# EAGLE design AY Soundcard (EAGLE 6.5.0)
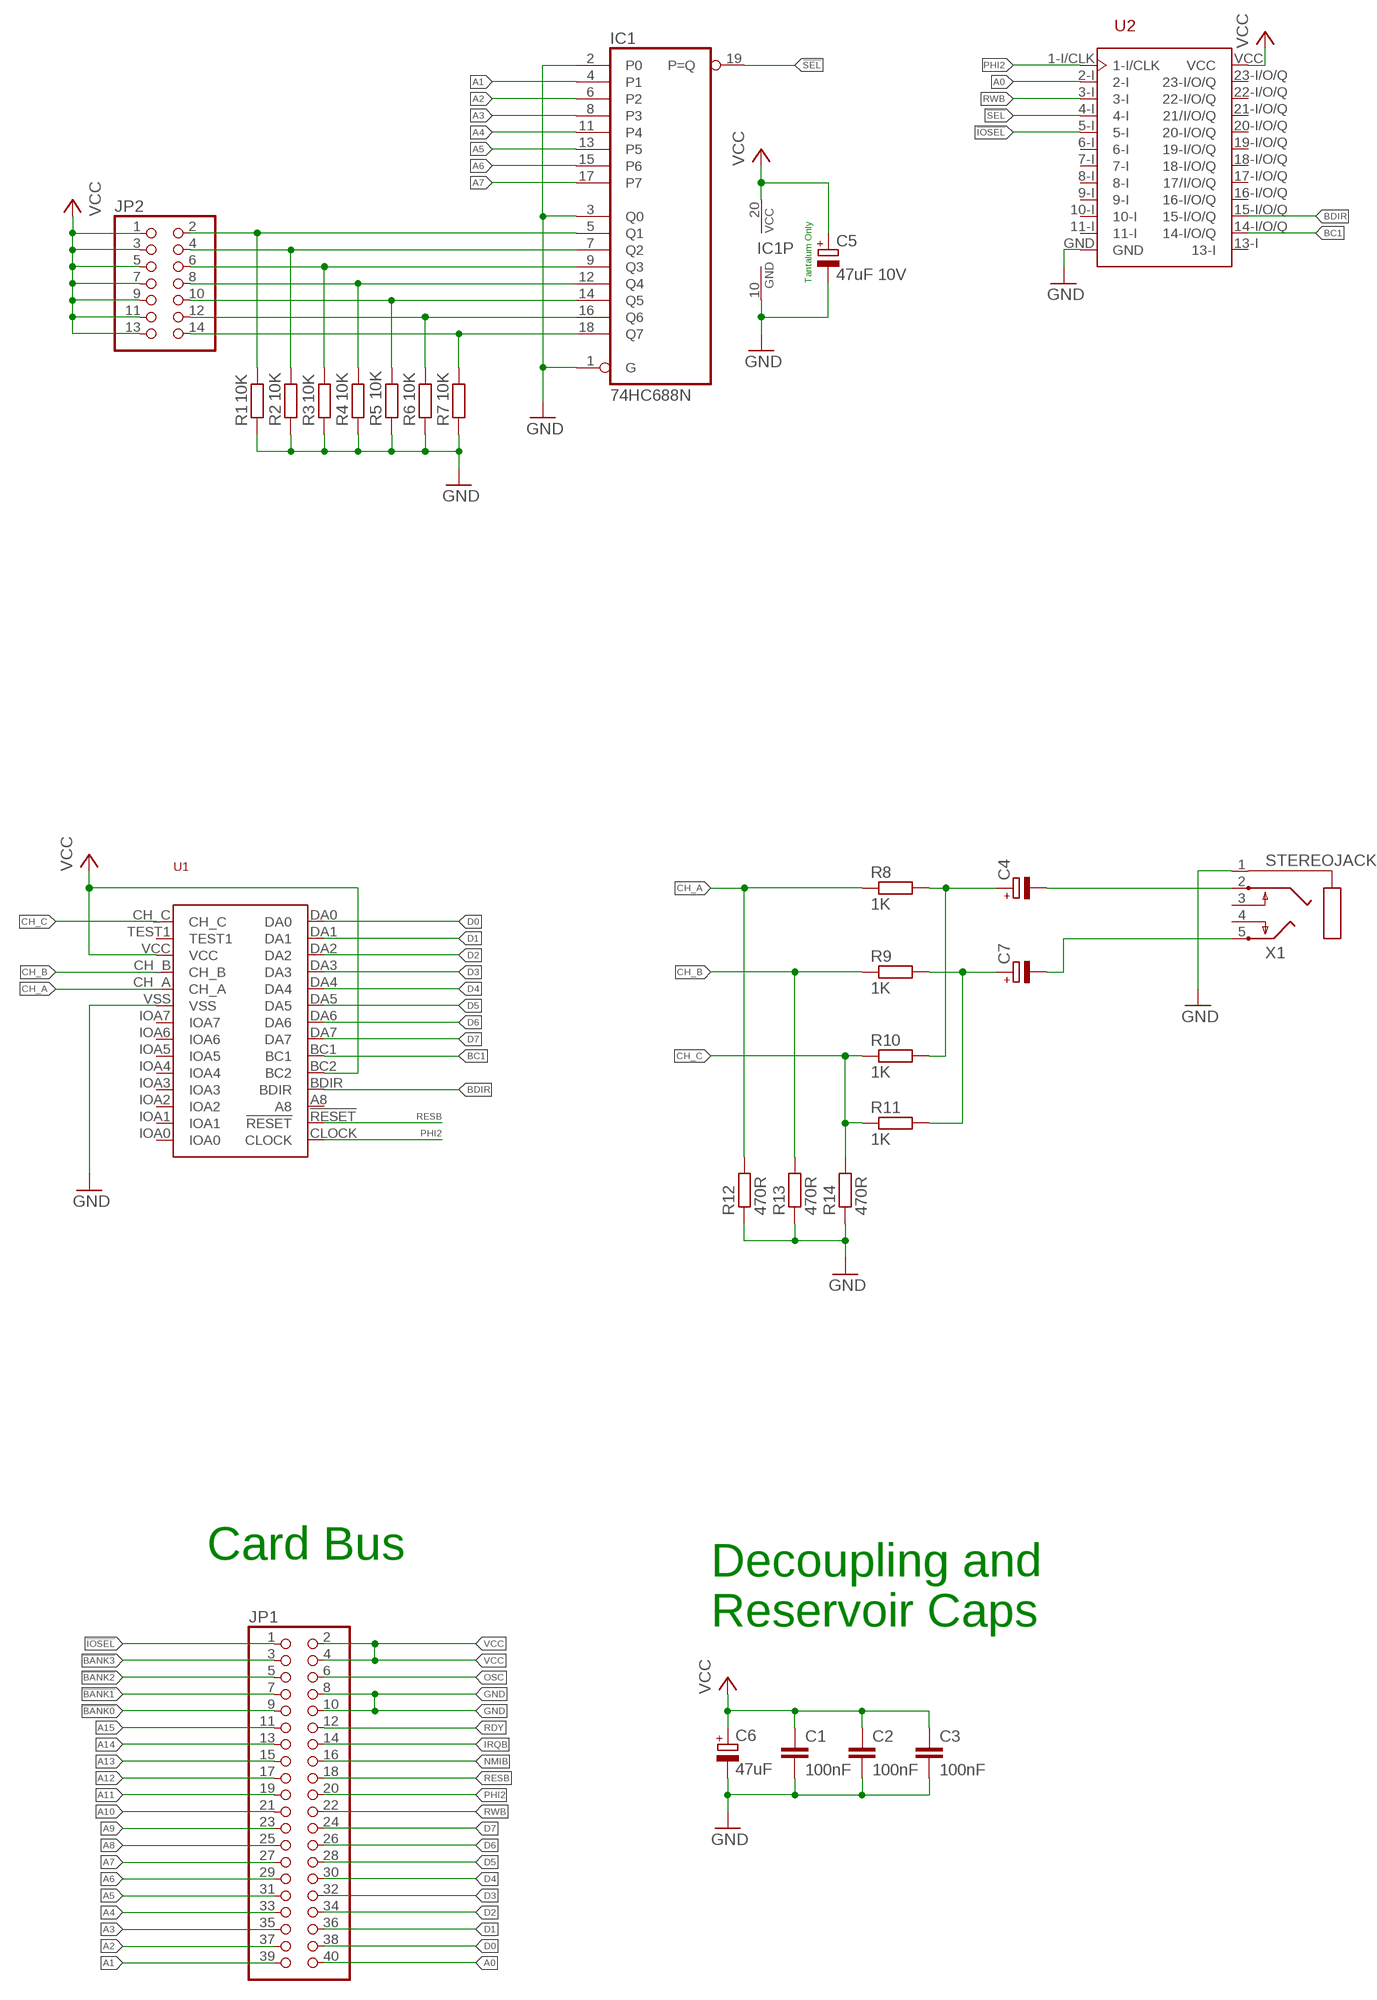
[diagram p0: schematic, sheet 1]

## Parts
C1  100nF  C-EU050-025X075  [C050-025X075]
C2  100nF  C-EU050-025X075  [C050-025X075]
C3  100nF  C-EU050-025X075  [C050-025X075]
C4  CPOL-EUE2-5  [E2-5]
C5  47uF 10V  CPOL-EUE5-6  [E5-6]
C6  47uF  CPOL-EUE2.5-7  [E2,5-7]
C7  CPOL-EUE2-5  [E2-5]
IC1  74HC688N  [DIL20]
JP1  PINHD-2X20/90  [2X20/90]
JP2  PINHD-2X7  [2X07]
R1  10K  R-EU_0207/2V  [0207/2V]
R2  10K  R-EU_0207/2V  [0207/2V]
R3  10K  R-EU_0207/2V  [0207/2V]
R4  10K  R-EU_0207/2V  [0207/2V]
R5  10K  R-EU_0207/2V  [0207/2V]
R6  10K  R-EU_0207/2V  [0207/2V]
R7  10K  R-EU_0207/2V  [0207/2V]
R8  1K  R-EU_0207/2V  [0207/2V]
R9  1K  R-EU_0207/2V  [0207/2V]
R10  1K  R-EU_0207/2V  [0207/2V]
R11  1K  R-EU_0207/2V  [0207/2V]
R12  470R  R-EU_0207/2V  [0207/2V]
R13  470R  R-EU_0207/10  [0207/10]
R14  470R  R-EU_0207/10  [0207/10]
U1  AY-3-8912-DIP  [DIP]
U2  GAL22V10D-DIP  [DIP24]
X1  STEREOJACK  [STX3100]

## Nets
!BANK0: JP1.9
!BANK1: JP1.7
!BANK2: JP1.5
!BANK3: JP1.3
!IOSEL: JP1.1 U2.5-I
!SEL: IC1.19(P=Q) U2.4-I
A0: JP1.40 U2.2-I
A1: IC1.4(P1) JP1.39
A2: IC1.6(P2) JP1.37
A3: IC1.8(P3) JP1.35
A4: IC1.11(P4) JP1.33
A5: IC1.13(P5) JP1.31
A6: IC1.15(P6) JP1.29
A7: IC1.17(P7) JP1.27
A8: JP1.25
A9: JP1.23
A10: JP1.21
A11: JP1.19
A12: JP1.17
A13: JP1.15
A14: JP1.13
A15: JP1.11
BC1: U1.BC1 U2.14-I/O/Q
BDIR: U1.BDIR U2.15-I/O/Q
CH_A: R8.1 R12.2 U1.CH_A
CH_B: R9.1 R13.2 U1.CH_B
CH_C: R10.1 R11.1 R14.2 U1.CH_C
D0: JP1.38 U1.DA0
D1: JP1.36 U1.DA1
D2: JP1.34 U1.DA2
D3: JP1.32 U1.DA3
D4: JP1.30 U1.DA4
D5: JP1.28 U1.DA5
D6: JP1.26 U1.DA6
D7: JP1.24 U1.DA7
GND: C1.2 C2.2 C3.2 C5.- C6.- IC1.1(G) IC1.2(P0) IC1.3(Q0) IC1.10(GND) JP1.8 JP1.10 R1.1 R2.1 R3.1 R4.1 R5.1 R6.1 R7.1 R12.1 R13.1 R14.1 U1.VSS U2.GND X1.1
IRQB: JP1.14
N$1: C4.+ R8.2 R10.2
N$2: C7.+ R9.2 R11.2
N$3: C4.- X1.2
N$4: C7.- X1.5
N$8: IC1.5(Q1) JP2.2 R1.2
N$9: IC1.7(Q2) JP2.4 R2.2
N$10: IC1.9(Q3) JP2.6 R3.2
N$11: IC1.12(Q4) JP2.8 R4.2
N$12: IC1.14(Q5) JP2.10 R5.2
N$13: IC1.16(Q6) JP2.12 R6.2
N$14: IC1.18(Q7) JP2.14 R7.2
NMIB: JP1.16
OSC: JP1.6
PHI2: JP1.20 U1.CLOCK U2.1-I/CLK
RDY: JP1.12
RESB: JP1.18 U1.!RESET
RWB: JP1.22 U2.3-I
VCC: C1.1 C2.1 C3.1 C5.+ C6.+ IC1.20(VCC) JP1.2 JP1.4 JP2.1 JP2.3 JP2.5 JP2.7 JP2.9 JP2.11 JP2.13 U1.BC2 U1.VCC U2.VCC
Unconnected: U1.A8 U1.IOA0 U1.IOA1 U1.IOA2 U1.IOA3 U1.IOA4 U1.IOA5 U1.IOA6 U1.IOA7 U1.TEST1 U2.6-I U2.7-I U2.8-I U2.9-I U2.10-I U2.11-I U2.13-I U2.16-I/O/Q U2.17-I/O/Q(17/I/O/Q) U2.18-I/O/Q U2.19-I/O/Q U2.20-I/O/Q U2.21-I/O/Q(21/I/O/Q) U2.22-I/O/Q U2.23-I/O/Q X1.3 X1.4

## Notes on the sheet
- Tantalum Only
- Card Bus
- Decoupling and
  Reservoir Caps

## Library data of the parts
C1-C3 = rcl:C-EU: CAPACITOR, European symbol
C4-C7 = rcl:CPOL-EU: POLARIZED CAPACITOR, European symbol
IC1 = 74xx-eu:74*688: 8-bit MAGNITUDE/IDENTITY COMPARATOR, totem pole
JP1 = pinhead:PINHD-2X20: PIN HEADER
JP2 = pinhead:PINHD-2X7: PIN HEADER
R1-R14 = rcl:R-EU_: RESISTOR, European symbol
U1 = ay-3-8912:AY-3-8912-DIP: Classic sound chip from the 80's Used in the Oric-1, Oric Atmos, Amstrad CPC's, some MSX's, Spectrum 128k machines etc.
U2 = GAL22V10D:GAL22V10D-DIP: GAL22V10 Generic Array Logic
X1 = adafruit:STEREOJACK: MIC/HEADPHONE JACK Stereo jack with two switches. Kycon STX3100, CUI SJ1-3555NG and/or 4UCon 05544

## Board
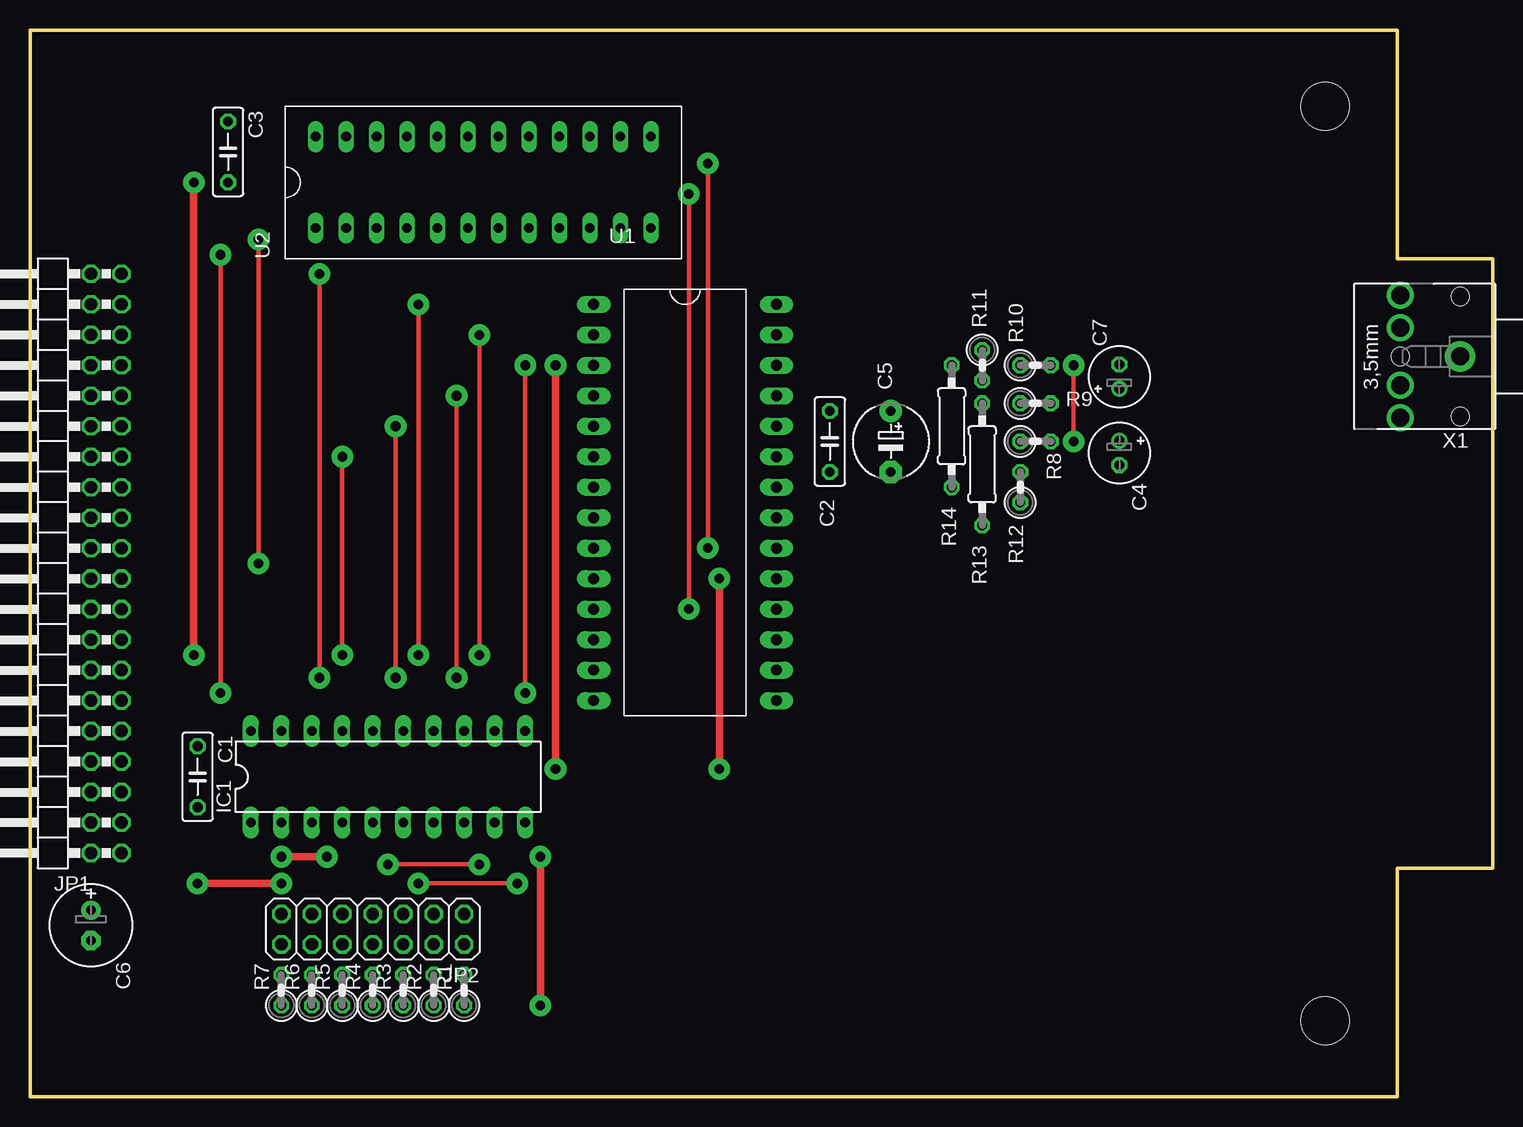
[diagram p1: board, top side]
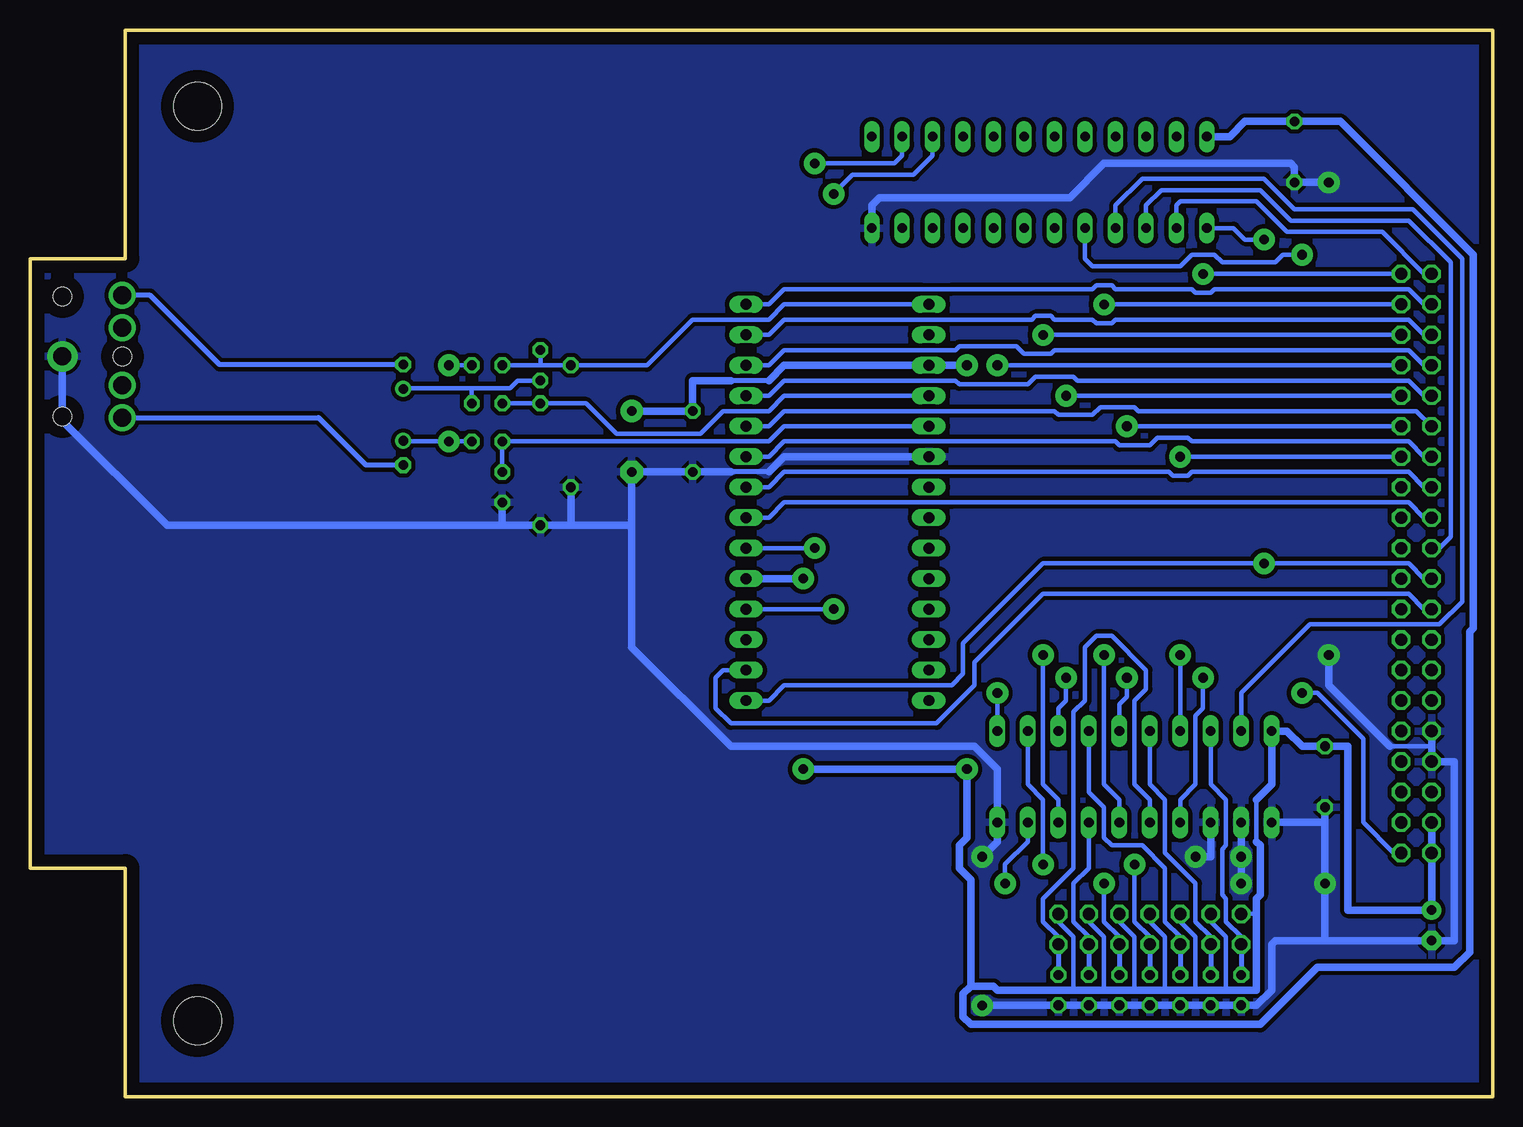
[diagram p2: board, bottom side, seen from below]

Size 121.92 x 88.9 mm. Coordinates in mm from the lower left corner, seen from the top.
Outline: 113.97,0 0,0 0,88.89 113.97,88.89
Outline: 113.98,88.9 113.98,69.85 121.92,69.85 121.92,19.05 113.98,19.05 113.98,0
Copper layers (1*16): Top 0.035mm / dielectric 1.5mm / Bottom 0.035mm
Design rules "default *": minimum track width 10mil, minimum drill 24mil, track to track 8mil, track to pad 8mil, pad to pad 8mil, via to via 8mil, smd to smd 8mil, copper to edge 40mil, drill to drill 8mil, minimum pad ring 10mil, minimum via ring 8mil, stop-mask expansion 4mil, vias tented up to drill 0mil, thermal gap 12mil
Holes 4 mm at 107.95,82.55 107.95,6.35

### Footprints (pad centres in the part's own frame; a part is rotated, then mirrored left to right if it is on the bottom)
C050-025X075 = drill 0.813 octagon: 1 -2.54,0; 2 2.54,0
E2-5 = drill 0.813 pad 1.27: + -1.016,0 | drill 0.813 pad 1.27 octagon: - 1.016,0
E5-6 = drill 0.813 pad 1.905: + -2.54,0 | drill 0.813 pad 1.905 octagon: - 2.54,0
E2,5-7 = drill 0.813 pad 1.6: + -1.27,0 | drill 0.813 pad 1.6 octagon: - 1.27,0
DIL20 = drill 0.813 long: 1 -11.43,-3.81; 2 -8.89,-3.81; 3 -6.35,-3.81; 4 -3.81,-3.81; 5 -1.27,-3.81; 6 1.27,-3.81; 7 3.81,-3.81; 8 6.35,-3.81; 9 8.89,-3.81; 10 11.43,-3.81; 11 11.43,3.81; 12 8.89,3.81; 13 6.35,3.81; 14 3.81,3.81; 15 1.27,3.81; 16 -1.27,3.81; 17 -3.81,3.81; 18 -6.35,3.81; 19 -8.89,3.81; 20 -11.43,3.81
2X20/90 = drill 1.016 octagon: 1 -24.13,-6.35; 2 -24.13,-3.81; 3 -21.59,-6.35; 4 -21.59,-3.81; 5 -19.05,-6.35; 6 -19.05,-3.81; 7 -16.51,-6.35; 8 -16.51,-3.81; 9 -13.97,-6.35; 10 -13.97,-3.81; 11 -11.43,-6.35; 12 -11.43,-3.81; 13 -8.89,-6.35; 14 -8.89,-3.81; 15 -6.35,-6.35; 16 -6.35,-3.81; 17 -3.81,-6.35; 18 -3.81,-3.81; 19 -1.27,-6.35; 20 -1.27,-3.81; 21 1.27,-6.35; 22 1.27,-3.81; 23 3.81,-6.35; 24 3.81,-3.81; 25 6.35,-6.35; 26 6.35,-3.81; 27 8.89,-6.35; 28 8.89,-3.81; 29 11.43,-6.35; 30 11.43,-3.81; 31 13.97,-6.35; 32 13.97,-3.81; 33 16.51,-6.35; 34 16.51,-3.81; 35 19.05,-6.35; 36 19.05,-3.81; 37 21.59,-6.35; 38 21.59,-3.81; 39 24.13,-6.35; 40 24.13,-3.81
2X07 = drill 1.016 octagon: 1 -7.62,-1.27; 2 -7.62,1.27; 3 -5.08,-1.27; 4 -5.08,1.27; 5 -2.54,-1.27; 6 -2.54,1.27; 7 0,-1.27; 8 0,1.27; 9 2.54,-1.27; 10 2.54,1.27; 11 5.08,-1.27; 12 5.08,1.27; 13 7.62,-1.27; 14 7.62,1.27
0207/2V = drill 0.813 octagon: 1 -1.27,0; 2 1.27,0
0207/10 = drill 0.813 octagon: 1 -5.08,0; 2 5.08,0
DIP = drill 0.9 long: !RESET 7.62,-15.24; A8 7.62,-12.7; BC1 7.62,-5.08; BC2 7.62,-7.62; BDIR 7.62,-10.16; CH_A -7.62,5.08; CH_B -7.62,7.62; CH_C -7.62,15.24; CLOCK 7.62,-17.78; DA0 7.62,15.24; DA1 7.62,12.7; DA2 7.62,10.16; DA3 7.62,7.62; DA4 7.62,5.08; DA5 7.62,2.54; DA6 7.62,0; DA7 7.62,-2.54; IOA0 -7.62,-17.78; IOA1 -7.62,-15.24; IOA2 -7.62,-12.7; IOA3 -7.62,-10.16; IOA4 -7.62,-7.62; IOA5 -7.62,-5.08; IOA6 -7.62,-2.54; IOA7 -7.62,0; TEST1 -7.62,12.7; VCC -7.62,10.16; VSS -7.62,2.54
DIP24 = drill 0.8 long: 1-I/CLK -3.81,13.97; 2-I -3.81,11.43; 3-I -3.81,8.89; 4-I -3.81,6.35; 5-I -3.81,3.81; 6-I -3.81,1.27; 7-I -3.81,-1.27; 8-I -3.81,-3.81; 9-I -3.81,-6.35; 10-I -3.81,-8.89; 11-I -3.81,-11.43; 13-I 3.81,-13.97; 14-I/O/Q 3.81,-11.43; 15-I/O/Q 3.81,-8.89; 16-I/O/Q 3.81,-6.35; 17-I/O/Q 3.81,-3.81; 18-I/O/Q 3.81,-1.27; 19-I/O/Q 3.81,1.27; 20-I/O/Q 3.81,3.81; 21-I/O/Q 3.81,6.35; 22-I/O/Q 3.81,8.89; 23-I/O/Q 3.81,11.43; GND -3.81,-13.97; VCC 3.81,13.97
STX3100 = drill 1.5 pad 2.54: 1 2.7,-0.1 | drill 1.5: 2 7.7,5; 3 7.7,2.3; 4 7.7,-2.5; 5 7.7,-5.2 | hole 1.5: 2.7,4.9; 2.7,-5.1; 7.7,-0.1

### Placement (x,y rotation side)
C1  13.97,26.67 270 top
C2  66.67,54.61 270 top
C3  16.51,78.74 270 top
C4  90.81,53.66 270 top
C5  71.75,54.61 270 top
C6  5.08,14.29 270 top
C7  90.81,60.01 90 top
IC1  29.84,26.67 0 top
JP1  1.27,44.45 90 top
JP2  28.57,13.97 180 top
R1  36.2,8.89 90 top
R2  33.66,8.89 90 top
R3  31.11,8.89 90 top
R4  28.57,8.89 90 top
R5  26.04,8.89 90 top
R6  23.5,8.89 90 top
R7  20.95,8.89 90 top
R8  83.82,54.61 0 top
R9  83.82,57.78 0 top
R10  83.82,60.96 0 top
R11  79.38,60.96 270 top
R12  82.55,50.8 90 top
R13  79.38,52.7 90 top
R14  76.83,55.88 90 top
U1  54.61,50.8 0 top
U2  37.78,76.2 90 top
X1  121.92,61.59 180 top

### Tracks (layer width: path | path; a pad name or v marks a point on that pad's centre or on a via)
!IOSEL  (via drill 0.8 pad 1.8)
  Top 0.356: v15.88,33.66 v15.88,70.17
  Bottom 0.356: JP1.1 8.26,20.32 10.79,22.86 10.79,29.84 14.61,33.66 v15.88,33.66 | v15.88,70.17 17.46,70.17 18.1,69.53 22.54,69.53 23.18,70.17 25.08,70.17 26.04,69.22 33.34,69.22 33.97,69.85 U2.5-I
!SEL
  Bottom 0.356: IC1.19 20.95,33.66 15.24,39.37 4.45,39.37 2.54,41.27 2.54,69.85 6.67,73.98 16.51,73.98 19.05,76.52 29.21,76.52 31.43,74.3 U2.4-I
A0
  Bottom 0.356: JP1.40 5.71,68.58 9.21,72.07 17.14,72.07 19.68,74.61 26.04,74.61 26.35,74.3 U2.2-I
A1  (via drill 0.8 pad 1.8)
  Top 0.356: v24.13,68.58 v24.13,34.92
  Bottom 0.356: JP1.39 v24.13,68.58 | v24.13,34.92 24.13,32.38 24.77,31.75 24.77,26.04 26.04,24.77 IC1.4
A2  (via drill 0.8 pad 1.8)
  Top 0.356: v32.38,66.04 v32.38,36.83
  Bottom 0.356: JP1.37 v32.38,66.04 | IC1.6 31.11,24.77 32.38,26.04 v32.38,36.83
A3  (via drill 0.8 pad 1.8)
  Top 0.356: v37.47,63.5 v37.47,36.83
  Bottom 0.356: JP1.35 v37.47,63.5 | v37.47,36.83 37.47,26.04 36.2,24.77 IC1.8
A4  (via drill 0.8 pad 1.8)
  Top 0.356: v41.27,60.96 v41.27,33.66
  Bottom 0.356: JP1.33 v41.27,60.96 | v41.27,33.66 IC1.11
A5  (via drill 0.8 pad 1.8)
  Top 0.356: v35.56,34.92 v35.56,58.42
  Bottom 0.356: IC1.13 36.2,32.38 35.56,33.02 v35.56,34.92 | v35.56,58.42 JP1.31
A6  (via drill 0.8 pad 1.8)
  Top 0.356: v30.48,34.92 v30.48,55.88
  Bottom 0.356: IC1.15 31.11,32.7 30.48,33.34 v30.48,34.92 | v30.48,55.88 JP1.29
A7  (via drill 0.8 pad 1.8)
  Top 0.356: v26.04,36.83 v26.04,53.34
  Bottom 0.356: IC1.17 v26.04,36.83 | v26.04,53.34 JP1.27
BC1  (via drill 0.8 pad 1.8)
  Top 0.356: v56.52,77.79 v56.52,45.72
  Bottom 0.356: U2.14-I/O/Q 49.21,78.42 49.85,77.79 v56.52,77.79 | v56.52,45.72 U1.BC1
BDIR  (via drill 0.8 pad 1.8)
  Top 0.356: v54.93,75.25 v54.93,40.64
  Bottom 0.356: U2.15-I/O/Q 46.67,78.42 48.26,76.83 53.34,76.83 v54.93,75.25 | v54.93,40.64 U1.BDIR
CH_A
  Bottom 0.356: U1.CH_A 59.05,55.88 60.33,54.61 R8.1 R12.2
CH_B
  Bottom 0.356: U1.CH_B 59.05,58.42 60.33,57.15 64.14,57.15 66.04,55.24 73.03,55.24 75.56,57.78 R13.2 R9.1
CH_C
  Bottom 0.356: U1.CH_C 59.05,66.04 60.33,64.77 66.67,64.77 70.48,60.96 R14.2 79.38,60.96 | 79.38,60.96 R10.1 | R11.1 79.38,60.96
D0
  Bottom 0.356: JP1.38 5.71,66.04 6.99,67.31 23.18,67.31 23.5,66.99 24.77,66.99 25.08,67.31 31.43,67.31 31.75,67.63 33.02,67.63 33.34,67.31 45.09,67.31 47.62,67.31 59.05,67.31 60.33,66.04 U1.DA0
D1
  Bottom 0.356: JP1.36 5.71,63.5 6.99,64.77 31.43,64.77 31.75,64.45 33.02,64.45 33.34,64.77 36.51,64.77 36.83,65.09 38.1,65.09 38.42,64.77 59.05,64.77 60.33,63.5 U1.DA1
D2
  Bottom 0.356: JP1.34 5.71,60.96 6.99,62.23 36.51,62.23 36.83,61.91 39.05,61.91 39.69,62.55 44.45,62.55 44.77,62.23 59.05,62.23 60.33,60.96 U1.DA2
D3
  Bottom 0.356: JP1.32 5.71,58.42 6.99,59.69 34.61,59.69 34.92,60.01 38.1,60.01 38.73,59.37 44.45,59.37 44.77,59.69 59.05,59.69 60.33,58.42 U1.DA3
D4
  Bottom 0.356: JP1.30 6.35,57.15 29.53,57.15 29.84,57.47 32.7,57.47 33.34,56.83 36.2,56.83 36.51,57.15 59.05,57.15 60.33,55.88 U1.DA4
D5
  Bottom 0.356: JP1.28 5.71,53.34 6.99,54.61 25.08,54.61 25.4,54.93 27.94,54.93 28.57,54.29 31.11,54.29 31.43,54.61 59.05,54.61 60.33,53.34 U1.DA5
D6
  Bottom 0.356: JP1.26 5.71,50.8 6.99,52.07 25.08,52.07 25.4,51.75 26.67,51.75 26.99,52.07 59.05,52.07 60.33,50.8 U1.DA6
D7
  Bottom 0.356: JP1.24 5.71,48.26 6.99,49.53 45.09,49.53 47.62,49.53 59.05,49.53 60.33,48.26 U1.DA7
GND  (via drill 0.8 pad 1.8)
  Top 0.61: v24.77,20 v20.95,20 | v13.97,17.78 v20.95,17.78 | v42.55,20 v42.55,7.62 | v13.65,76.2 v13.65,36.83
  Bottom 0.356: 8.57,29.21 5.08,29.21
  Bottom 0.406: 60.33,52.07 63.5,52.07
  Bottom 0.61: IC1.2 v20.95,20 v20.95,17.78 | JP1.10 5.08,29.21 JP1.8 3.17,27.94 3.17,13.02 C6.- 13.97,13.02 | U1.VSS 59.05,53.34 60.33,52.07 | 63.5,52.07 C2.2 C5.- 71.75,47.62 | 13.97,13.02 18.1,13.02 18.41,12.7 18.41,8.89 19.68,7.62 R7.1 R6.1 R5.1 R4.1 R3.1 R2.1 R1.1 v42.55,7.62 | C1.2 13.97,22.86 | 13.97,22.86 v13.97,17.78 13.97,13.02 | IC1.1 13.97,22.86 | IC1.3 23.5,20 v24.77,20 | U2.GND 51.75,74.3 51.12,74.93 35.24,74.93 32.38,77.79 16.83,77.79 16.51,77.47 C3.2 v13.65,76.2 | v42.55,20 41.27,21.27 IC1.10 41.27,27.3 43.18,29.21 63.5,29.21 71.75,37.47 71.75,47.62 | v13.65,36.83 13.65,34.29 8.57,29.21 | 76.83,47.62 R13.1 82.55,47.62 | R14.1 76.83,47.62 | 76.83,47.62 71.75,47.62 | X1.1 119.22,56.35 110.49,47.62 82.55,47.62 | R12.1 82.55,47.62
  pour Bottom (isolate 0.356): 0,88.9 113.98,88.9 113.98,69.85 121.92,69.85 121.92,19.05 113.98,19.05 113.98,0 0,0
N$1  (via drill 0.8 pad 1.8)
  Top 0.356: v87,60.96 v87,54.61
  Bottom 0.356: R8.2 v87,54.61 90.74,54.61 C4.+ | R10.2 v87,60.96
N$2
  Bottom 0.356: R11.2 81.28,59.69 81.92,59.05 85.09,59.05 | 85.09,59.05 R9.2 | 85.09,59.05 90.74,59.05 C7.+
N$3
  Bottom 0.406: C4.- 93.92,52.64 97.87,56.59 X1.2
N$4
  Bottom 0.406: C7.- 106.11,61.02 111.88,66.8 X1.5
N$8
  Bottom 0.356: JP2.2 36.2,13.34 37.47,14.61 37.47,16.51 34.92,19.05 34.92,32.07 33.97,33.02 33.97,37.47 33.02,38.42 31.75,38.42 28.89,35.56 28.89,33.97 29.84,33.02 29.84,26.04 28.57,24.77 IC1.5
  Bottom 0.406: JP2.2 R1.2
N$9
  Bottom 0.356: JP2.4 33.66,13.34 34.92,14.61 34.92,17.78 33.66,19.05 IC1.7
  Bottom 0.406: JP2.4 R2.2
N$10  (via drill 0.8 pad 1.8)
  Top 0.356: v32.38,17.78 v40.64,17.78
  Bottom 0.356: JP2.6 31.11,13.34 32.38,14.61 v32.38,17.78 | v40.64,17.78 40.64,19.37 38.73,21.27 IC1.9
  Bottom 0.406: JP2.6 R3.2
N$11  (via drill 0.8 pad 1.8)
  Top 0.356: v37.47,19.37 v29.84,19.37
  Bottom 0.356: JP2.8 28.57,13.34 29.84,14.61 v29.84,19.37 | IC1.12 38.73,26.04 37.47,24.77 v37.47,19.37
  Bottom 0.406: JP2.8 R4.2
N$12
  Bottom 0.356: JP2.10 26.04,13.34 27.3,14.61 27.3,19.05 29.21,20.95 31.75,20.95 32.38,21.59 32.38,24.13 33.66,25.4 IC1.14
  Bottom 0.406: JP2.10 R5.2
N$13
  Bottom 0.356: JP2.12 23.5,13.34 24.77,14.61 24.77,17.78 27.3,20.32 27.3,24.77 28.57,26.04 IC1.16
  Bottom 0.406: JP2.12 R6.2
N$14
  Bottom 0.356: JP2.14 20.95,13.34 22.23,14.61 22.23,16.51 22.54,16.83 22.54,20.64 22.23,20.95 22.23,24.77 23.5,26.04 IC1.18
  Bottom 0.406: JP2.14 R7.2
PHI2  (via drill 0.8 pad 1.8)
  Top 0.356: v19.05,71.44 v19.05,44.45
  Bottom 0.356: JP1.20 5.71,43.18 6.99,44.45 v19.05,44.45 37.47,44.45 44.13,37.78 44.13,35.24 45.09,34.29 59.05,34.29 60.33,33.02 U1.CLOCK | U2.1-I/CLK 21.59,72.39 20.64,71.44 v19.05,71.44
RESB
  Bottom 0.356: JP1.18 5.71,40.64 6.99,41.91 37.47,41.91 43.18,36.2 43.18,34.29 46.35,31.11 63.5,31.11 64.77,32.38 64.77,34.92 64.14,35.56 U1.!RESET
RWB
  Bottom 0.356: U2.3-I 28.89,74.3 27.62,75.56 19.37,75.56 16.83,73.03 6.99,73.03 3.49,69.53 3.49,46.67 4.45,45.72 JP1.22
VCC  (via drill 0.8 pad 1.8)
  Top 0.61: v57.47,43.18 v57.47,27.3 | v43.81,60.96 v43.81,27.3
  Bottom 0.356: JP2.1 36.2,14.61 34.92,13.34 34.92,8.89 | JP2.3 33.66,14.61 32.38,13.34 32.38,8.89 | JP2.5 31.11,14.61 29.84,13.34 29.84,8.89 | JP2.7 28.57,14.61 27.3,13.34 27.3,8.89 | JP2.9 26.04,14.61 24.77,13.34 24.77,8.89 | JP2.11 23.5,14.61 22.23,13.34 22.23,8.89 | 19.68,24.77 19.68,21.27 | 19.68,15.24 JP2.13
  Bottom 0.406: 60.33,59.69 63.5,59.69
  Bottom 0.61: 19.68,24.77 18.41,26.04 IC1.20 17.14,30.48 15.88,29.21 C1.1 12.06,29.21 12.06,15.56 C6.+ JP1.2 JP1.4 | 19.68,21.27 19.37,20.95 19.37,16.83 19.68,16.51 19.68,15.24 19.68,8.89 22.23,8.89 24.77,8.89 27.3,8.89 29.84,8.89 32.38,8.89 34.92,8.89 41.27,8.89 41.59,9.21 43.5,9.21 | 60.33,59.69 59.05,60.96 U1.VCC v43.81,60.96 | 63.5,59.69 66.67,59.69 C2.1 C5.+ | U1.BC2 v57.47,43.18 | 43.5,9.21 43.5,18.1 44.45,19.05 44.45,20.95 43.81,21.59 v43.81,27.3 v57.47,27.3 | 43.5,9.21 44.13,8.57 44.13,6.67 43.5,6.03 19.37,6.03 14.61,10.79 3.17,10.79 1.91,12.06 1.91,38.73 1.59,39.05 1.59,70.17 12.7,81.28 C3.1 20.64,81.28 21.91,80.01 U2.VCC